# Altium schematic sheet TOP_Sch.SchDoc
size A4; SheetNumber: 1; SheetTotal: 4
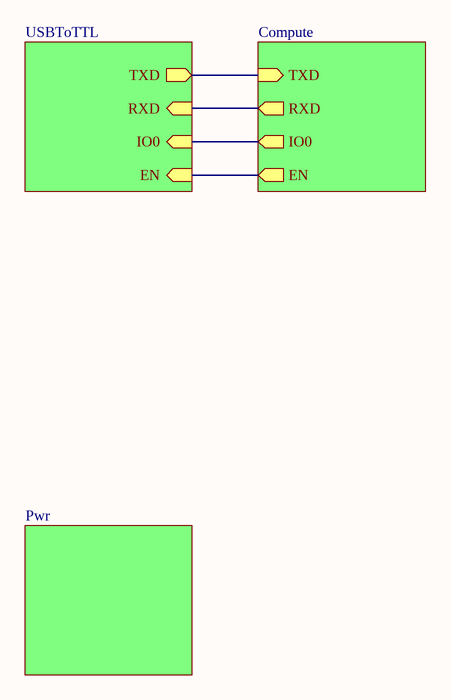
[diagram p0: TOP_Sch.SchDoc]

## Sub-sheets
Designator = USBToTTL: TXD (out), RXD (in), IO0 (in), EN (in)
Designator = Compute: TXD (in), RXD (out), IO0 (out), EN (out)
Designator = Pwr: no entries

## Nets
(unnamed): sheet Designator/TXD, sheet Designator/TXD
(unnamed): sheet Designator/RXD, sheet Designator/RXD
(unnamed): sheet Designator/IO0, sheet Designator/IO0
(unnamed): sheet Designator/EN, sheet Designator/EN